# EAGLE design DAWA-SWITCH-6.3 (EAGLE 9.5.0)
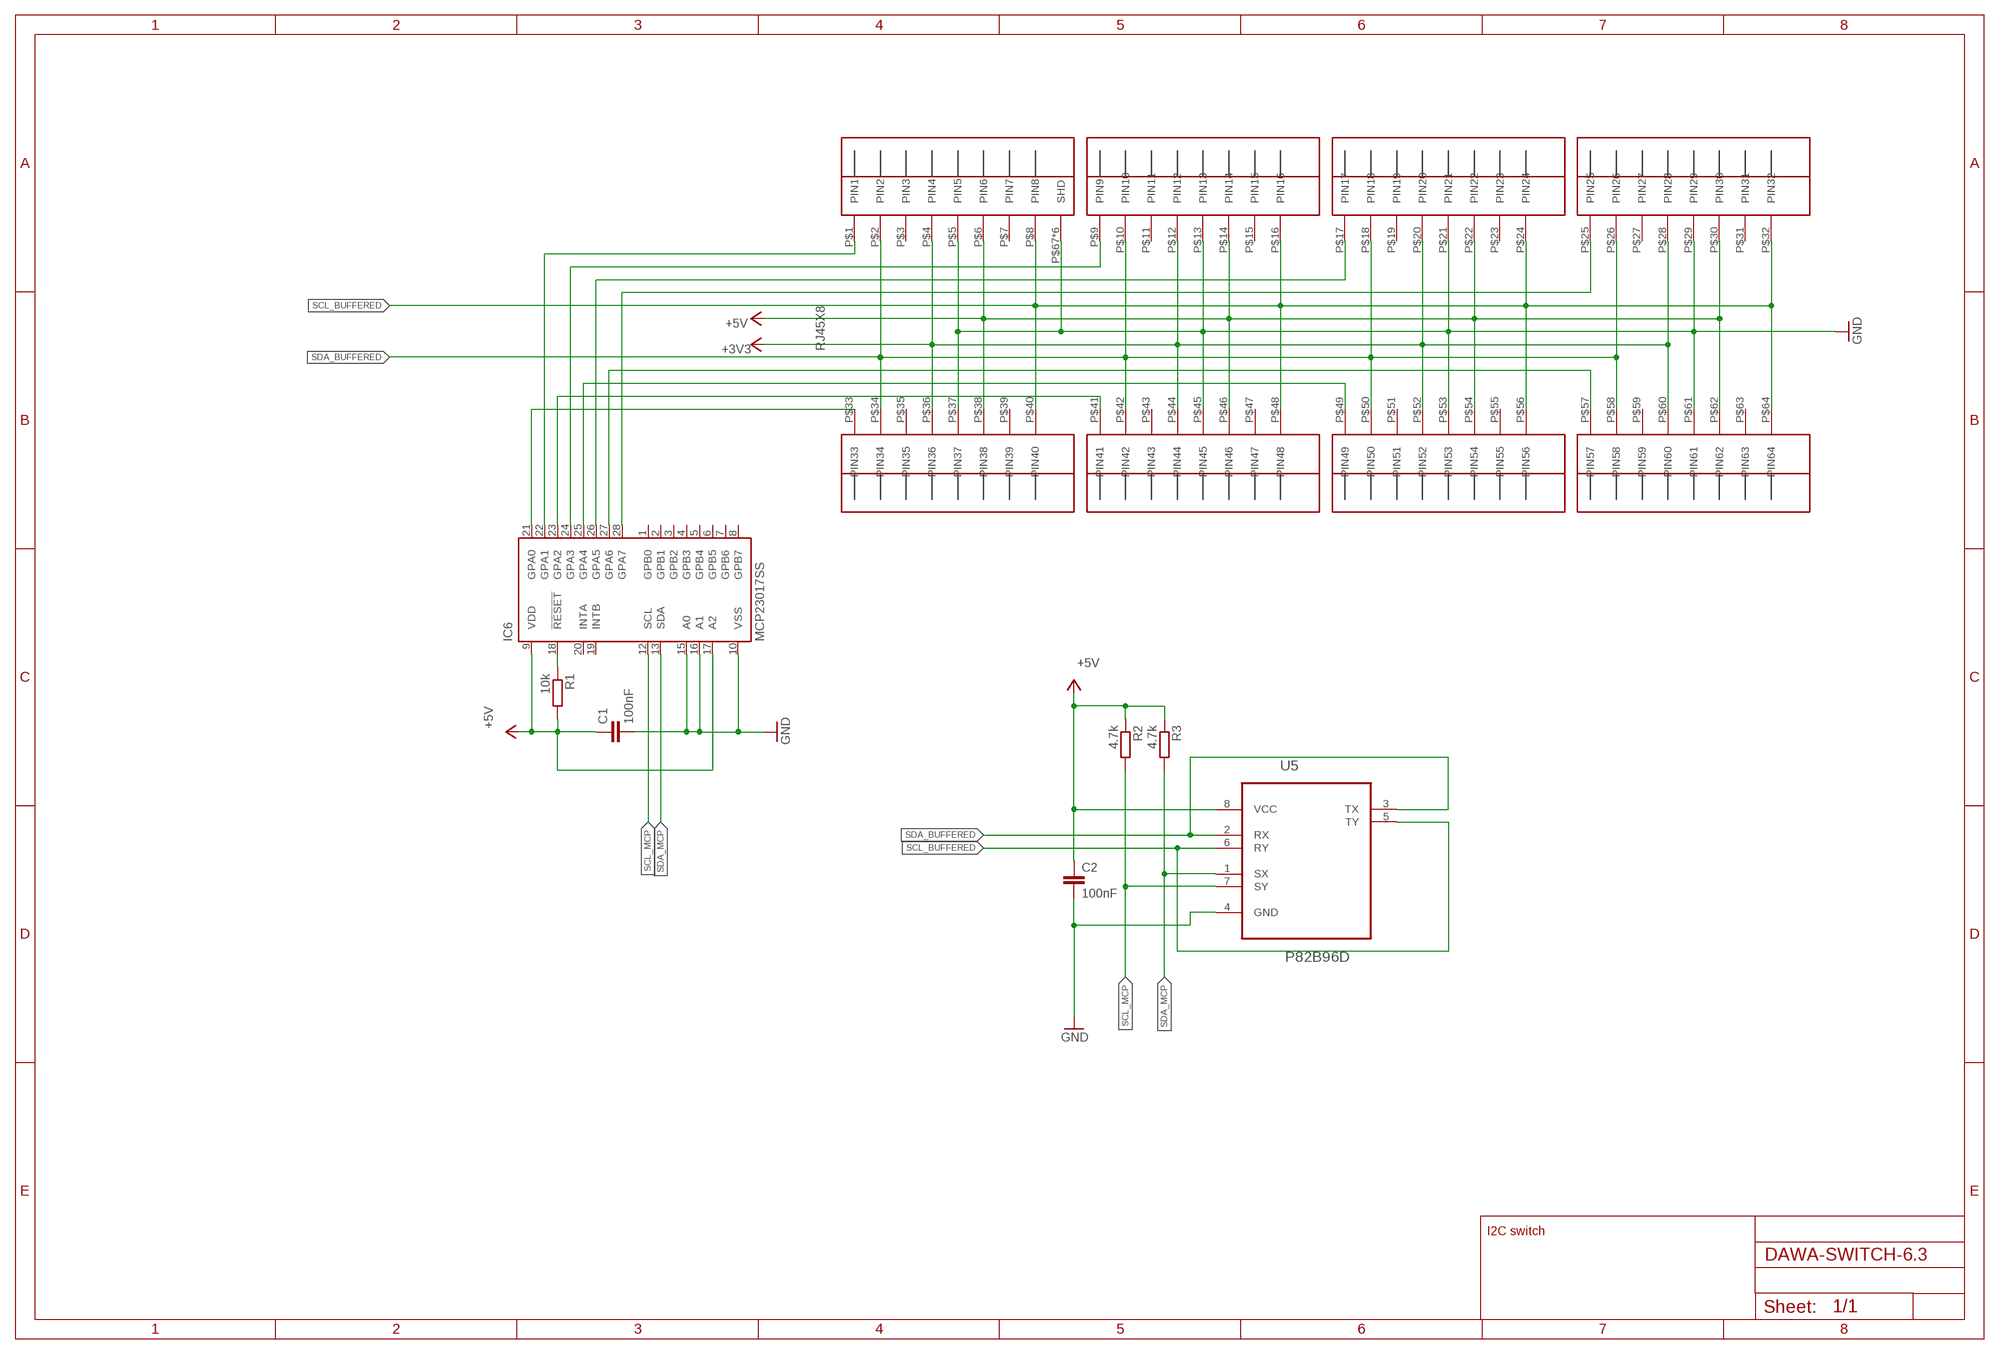
[diagram p0: schematic, sheet 1]

## Parts
C1  100nF  C-EUC0603  [C0603]
C2  100nF  C-EUC0603  [C0603]
IC6  MCP23017SS  [SSOP28]
R1  10k  R-EU_R0603  [R0603]
R2  4.7k  R-EU_R0603  [R0603]
R3  4.7k  R-EU_R0603  [R0603]
U5  P82B96D  [SOIC127P600X175-8N]
U$18  RJ45X8  [RJ45X8]

## Nets
+3V3: U$18.P$4(PIN4) U$18.P$12(PIN12) U$18.P$20(PIN20) U$18.P$28(PIN28) U$18.P$36(PIN36) U$18.P$44(PIN44) U$18.P$52(PIN52) U$18.P$60(PIN60)
+5V: C1.1 C2.1 IC6.9(VDD) IC6.17(A2) R1.2 R2.1 R3.1 U5.8(VCC) U$18.P$6(PIN6) U$18.P$14(PIN14) U$18.P$22(PIN22) U$18.P$30(PIN30) U$18.P$38(PIN38) U$18.P$46(PIN46) U$18.P$54(PIN54) U$18.P$62(PIN62)
GND: C1.2 C2.2 IC6.10(VSS) IC6.15(A0) IC6.16(A1) U5.4(GND) U$18.P$5(PIN5) U$18.P$13(PIN13) U$18.P$21(PIN21) U$18.P$29(PIN29) U$18.P$37(PIN37) U$18.P$45(PIN45) U$18.P$53(PIN53) U$18.P$61(PIN61) U$18.P$67(SHD) U$18.P$68(SHD) U$18.P$69(SHD) U$18.P$70(SHD) U$18.P$71(SHD) U$18.P$72(SHD)
N$35: IC6.28(GPA7) U$18.P$25(PIN25)
N$39: IC6.26(GPA5) U$18.P$17(PIN17)
N$40: IC6.24(GPA3) U$18.P$9(PIN9)
N$52: IC6.22(GPA1) U$18.P$1(PIN1)
N$53: IC6.21(GPA0) U$18.P$33(PIN33)
N$54: IC6.23(GPA2) U$18.P$41(PIN41)
N$55: IC6.25(GPA4) U$18.P$49(PIN49)
N$56: IC6.27(GPA6) U$18.P$57(PIN57)
N$57: IC6.18(!RESET) R1.1
SCL_BUFFERED: U5.5(TY) U5.6(RY) U$18.P$8(PIN8) U$18.P$16(PIN16) U$18.P$24(PIN24) U$18.P$32(PIN32) U$18.P$40(PIN40) U$18.P$48(PIN48) U$18.P$56(PIN56) U$18.P$64(PIN64)
SCL_MCP: IC6.12(SCL) R2.2 U5.7(SY)
SDA_BUFFERED: U5.2(RX) U5.3(TX) U$18.P$2(PIN2) U$18.P$10(PIN10) U$18.P$18(PIN18) U$18.P$26(PIN26) U$18.P$34(PIN34) U$18.P$42(PIN42) U$18.P$50(PIN50) U$18.P$58(PIN58)
SDA_MCP: IC6.13(SDA) R3.2 U5.1(SX)
Unconnected: IC6.1(GPB0) IC6.2(GPB1) IC6.3(GPB2) IC6.4(GPB3) IC6.5(GPB4) IC6.6(GPB5) IC6.7(GPB6) IC6.8(GPB7) IC6.19(INTB) IC6.20(INTA) U$18.P$3(PIN3) U$18.P$7(PIN7) U$18.P$11(PIN11) U$18.P$15(PIN15) U$18.P$19(PIN19) U$18.P$23(PIN23) U$18.P$27(PIN27) U$18.P$31(PIN31) U$18.P$35(PIN35) U$18.P$39(PIN39) U$18.P$43(PIN43) U$18.P$47(PIN47) U$18.P$51(PIN51) U$18.P$55(PIN55) U$18.P$59(PIN59) U$18.P$63(PIN63)

## Notes on the sheet
- I2C switch

## Library data of the parts
C1 = rcl:C-EU: CAPACITOR, European symbol; SPICEPREFIX: C
C2 = rcl:C-EU: CAPACITOR, European symbol
IC6 = adafruit:MCP23017: http://ww1.microchip.com/downloads/en/DeviceDoc/21952a.pdf Source: http://ww1.microchip.com/downloads/en/DeviceDoc/21952a.pdf
R1 = rcl:R-EU_: RESISTOR, European symbol; SPICEPREFIX: R
R2 R3 = resistor:R-EU_: RESISTOR, European symbol
U5 = TI:P82B96D: DUAL BIDIRECTIONAL BUS BUFFER; MPN: P82B96D; OC_FARNELL: 1831235; OC_NEWARK: 88K6383; PACKAGE: SOIC-8; SUPPLIER: Texas Instruments
U$18 = RJ45 Jack:RJ45X8

## Net classes
0 default: width 0.203 mm, drill 0.406 mm, clearance 0.203 mm
3 usbvcc: width 0.203 mm, drill 0.406 mm, clearance 0.203 mm
4 USBpair: width 0.254 mm, drill 0.406 mm, clearance 0.61 mm

## Board
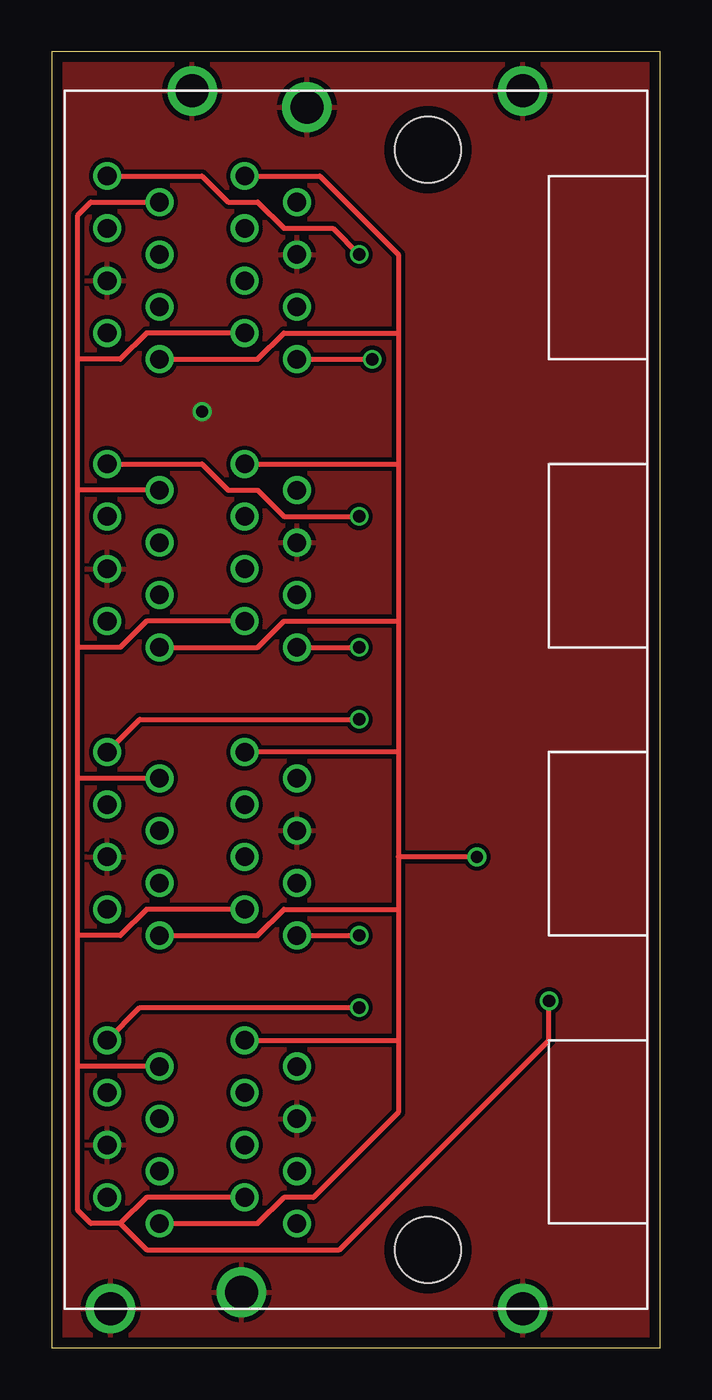
[diagram p1: board, top side]
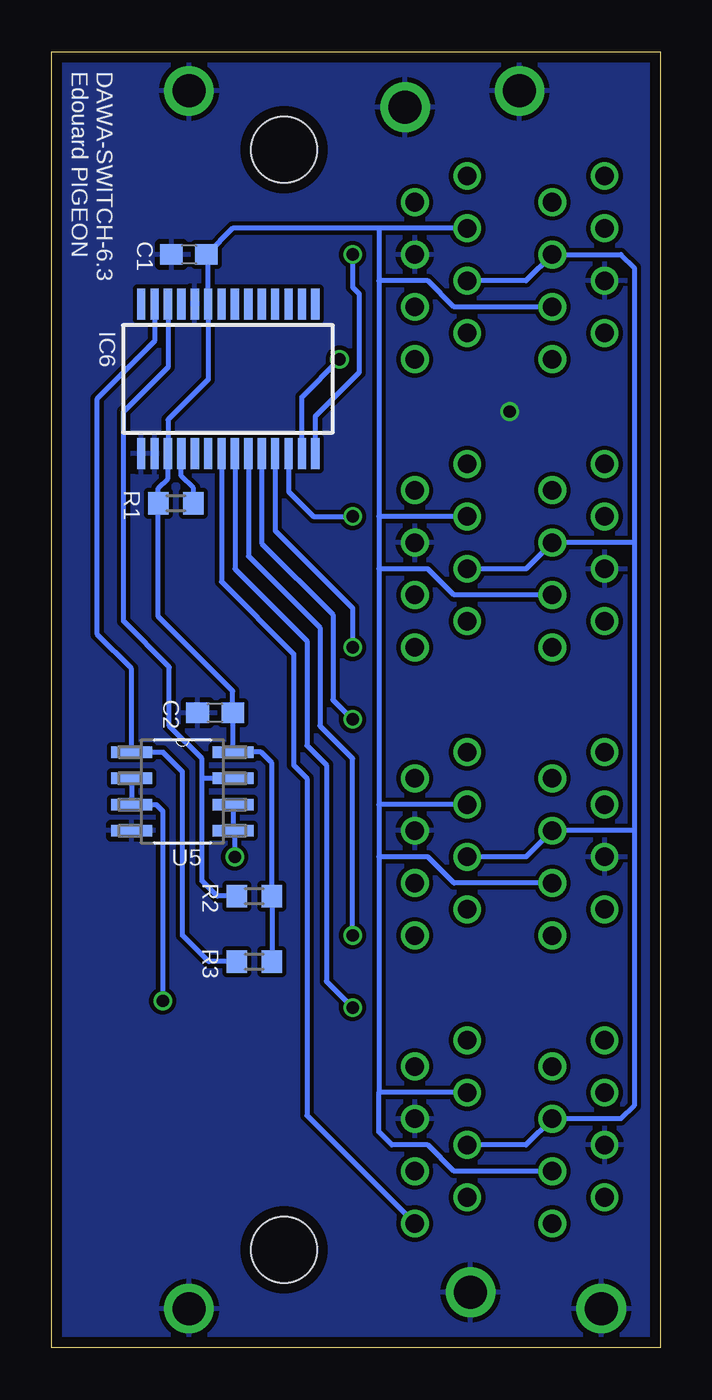
[diagram p2: board, bottom side, seen from below]

Size 29.53 x 62.87 mm. Coordinates in mm from the lower left corner, seen from the top.
Outline: 0,62.87 0,0 29.53,0 29.53,62.87 0,62.87
Copper layers (1*16): Top 0.035mm / dielectric 1.6mm / Bottom 0.035mm
Design rules "Elecrow_2-layer_PCB_eagle_rule *": minimum track width 6mil, minimum drill 12mil, track to track 6mil, track to pad 6mil, pad to pad 6mil, via to via 6mil, smd to smd 0mil, copper to edge 20mil, drill to drill 10mil, minimum pad ring 6mil, minimum via ring 6mil, stop-mask expansion 0mil, vias tented up to drill 100mil, thermal gap 10mil

### Footprints (pad centres in the part's own frame; a part is rotated, then mirrored left to right if it is on the bottom)
C0603 = smd 1.1 x 1: 1 -0.85,0; 2 0.85,0
SSOP28 = smd 0.4 x 1.5: 1 -4.225,-3.625; 2 -3.575,-3.625; 3 -2.925,-3.625; 4 -2.275,-3.625; 5 -1.625,-3.625; 6 -0.975,-3.625; 7 -0.325,-3.625; 8 0.325,-3.625; 9 0.975,-3.625; 10 1.625,-3.625; 11 2.275,-3.625; 12 2.925,-3.625; 13 3.575,-3.625; 14 4.225,-3.625; 15 4.225,3.625; 16 3.575,3.625; 17 2.925,3.625; 18 2.275,3.625; 19 1.625,3.625; 20 0.975,3.625; 21 0.325,3.625; 22 -0.325,3.625; 23 -0.975,3.625; 24 -1.625,3.625; 25 -2.275,3.625; 26 -2.925,3.625; 27 -3.575,3.625; 28 -4.225,3.625
R0603 = smd 1 x 1.1: 1 -0.85,0; 2 0.85,0
SOIC127P600X175-8N = smd 1.981 x 0.559: 1 -2.464,1.905; 2 -2.464,0.635; 3 -2.464,-0.635; 4 -2.464,-1.905; 5 2.464,-1.905; 6 2.464,-0.635; 7 2.464,0.635; 8 2.464,1.905
RJ45X8 = drill 0.9: P$1 13.018,22.701; P$2 11.748,20.161; P$3 10.477,22.701; P$4 9.207,20.161; P$5 7.938,22.701; P$6 6.668,20.161; P$7 5.397,22.701; P$8 4.128,20.161; P$9 26.988,22.701; P$10 25.718,20.161; P$11 24.448,22.701; P$12 23.177,20.161; P$13 21.907,22.701; P$14 20.637,20.161; P$15 19.367,22.701; P$16 18.098,20.161; P$17 40.958,22.701; P$18 39.688,20.161; P$19 38.417,22.701; P$20 37.148,20.161; P$21 35.877,22.701; P$22 34.608,20.161; P$23 33.337,22.701; P$24 32.068,20.161; P$25 54.928,22.701; P$26 53.657,20.161; P$27 52.388,22.701; P$28 51.117,20.161; P$29 49.847,22.701; P$30 48.578,20.161; P$31 47.307,22.701; P$32 46.038,20.161; P$33 4.128,13.494; P$34 5.397,16.034; P$35 6.668,13.494; P$36 7.938,16.034; P$37 9.207,13.494; P$38 10.477,16.034; P$39 11.748,13.494; P$40 13.018,16.034; P$41 18.098,13.494; P$42 19.367,16.034; P$43 20.637,13.494; P$44 21.907,16.034; P$45 23.177,13.494; P$46 24.448,16.034; P$47 25.718,13.494; P$48 26.988,16.034; P$49 32.068,13.494; P$50 33.337,16.034; P$51 34.608,13.494; P$52 35.877,16.034; P$53 37.148,13.494; P$54 38.417,16.034; P$55 39.688,13.494; P$56 40.958,16.034; P$57 46.038,13.494; P$58 47.307,16.034; P$59 48.578,13.494; P$60 49.847,16.034; P$61 51.117,13.494; P$62 52.388,16.034; P$63 53.657,13.494; P$64 54.928,16.034 | drill 1.6: P$67 0,22.543; P$68 0.794,16.192; P$69 0,2.54; P$70 59.055,2.54; P$71 58.261,13.018; P$72 59.055,18.574 | hole 3.2: 2.857,7.144; 56.197,7.144

### Placement (x,y rotation side)
C1  22.86,53.02 180 bottom
C2  21.59,30.8 180 bottom
IC6  20.95,46.99 180 bottom
R1  23.5,40.96 180 bottom
R2  19.68,21.91 180 bottom
R3  19.68,18.73 180 bottom
U5  23.18,26.99 0 bottom
U$18  25.4,1.91 90 top

### Tracks (layer width: path | path; a pad name or v marks a point on that pad's centre or on a via)
+3V3
  Bottom 0.254: U$18.P$60 6.51,51.75 U$18.P$28 1.91,53.02 1.27,52.39 1.27,39.05 | 1.27,39.05 1.27,25.08 | 1.27,25.08 1.27,11.75 1.91,11.11 U$18.P$4 6.51,9.84 U$18.P$36 | 1.27,25.08 U$18.P$12 6.51,23.81 U$18.P$44 | 1.27,39.05 U$18.P$20 6.51,37.78 U$18.P$52
+5V
  Bottom 0.254: R3.1 R2.1 18.84,28.36 19.37,28.89 U5.8 20.71,30.77 C2.1 20.74,31.85 24.34,35.46 R1.2 24.34,41.7 23.88,42.16 IC6.17 23.88,45.02 21.93,46.97 IC6.9 21.93,52.94 C1.1 20.74,54.29 13.65,54.29 | U$18.P$62 13.65,54.29 | 13.65,54.29 13.65,51.75 | 13.65,51.75 13.65,40.32 | 13.65,40.32 13.65,37.78 | 13.65,37.78 13.65,26.35 | 13.65,26.35 13.65,23.81 | 13.65,23.81 13.65,12.38 | U$18.P$6 10,8.57 11.27,9.84 13.02,9.84 13.65,10.48 13.65,12.38 | U$18.P$38 13.65,12.38 | U$18.P$14 10,22.54 11.27,23.81 13.65,23.81 | U$18.P$46 13.65,26.35 | U$18.P$22 10,36.51 11.27,37.78 13.65,37.78 | U$18.P$54 13.65,40.32 | U$18.P$30 10,50.48 11.27,51.75 13.65,51.75
GND  (via drill 0.6)
  other vias: 7.3,45.4
  pour Top: 29.53,0 0,0 0,62.87 29.53,62.87
  pour Bottom: 29.53,0 0,0 0,62.87 29.53,62.87
N$35  (via drill 0.6)
  Top 0.254: U$18.P$25 7.3,56.83 8.57,55.56 10,55.56 11.27,54.29 13.65,54.29 v14.92,53.02
  Bottom 0.254: IC6.28 16.73,45.18 14.61,47.31 14.61,51.12 14.92,51.44 v14.92,53.02
N$39  (via drill 0.6)
  Top 0.254: U$18.P$17 7.3,42.86 8.57,41.59 10,41.59 11.27,40.32 v14.92,40.32
  Bottom 0.254: v14.92,40.32 16.83,40.32 18.03,41.52 IC6.26
N$40  (via drill 0.6)
  Top 0.254: U$18.P$9 4.29,30.48 v14.92,30.48
  Bottom 0.254: v14.92,30.48 15.88,31.43 15.88,35.56 19.33,39.02 IC6.24
N$52  (via drill 0.6)
  Top 0.254: U$18.P$1 4.29,16.51 v14.92,16.51
  Bottom 0.254: v14.92,16.51 16.19,17.78 16.19,28.26 17.14,29.21 17.14,34.29 20.63,37.77 IC6.22
N$53
  Bottom 0.254: U$18.P$33 17.14,11.27 17.14,27.62 17.78,28.26 17.78,33.66 21.28,37.16 IC6.21
N$54  (via drill 0.6)
  Top 0.254: U$18.P$41 v14.92,20
  Bottom 0.254: v14.92,20 14.92,28.57 16.51,30.16 16.51,34.92 19.98,38.4 IC6.23
N$55  (via drill 0.6)
  Top 0.254: U$18.P$49 v14.92,33.97
  Bottom 0.254: v14.92,33.97 14.92,35.88 18.68,39.63 IC6.25
N$56  (via drill 0.6)
  Top 0.254: U$18.P$57 v15.56,47.94
  Bottom 0.254: IC6.27 17.38,46.12 v15.56,47.94
N$57
  Bottom 0.254: IC6.18 23.23,42.28 22.64,41.7 R1.1
SCL_BUFFERED  (via drill 0.6)
  Top 0.254: 16.83,49.21 16.83,53.02 13.02,56.83 U$18.P$64 | 16.83,49.21 16.83,42.86 | 16.83,42.86 16.83,35.24 | 16.83,35.24 16.83,28.89 | 16.83,28.89 16.83,23.81 | v20.64,23.81 16.83,23.81 | 16.83,28.89 U$18.P$48 | U$18.P$56 16.83,42.86 | 16.83,23.81 16.83,21.27 | 16.83,21.27 16.83,14.92 | U$18.P$40 16.83,14.92 | U$18.P$32 10,47.94 11.27,49.21 16.83,49.21 | U$18.P$24 10,33.97 11.27,35.24 16.83,35.24 | U$18.P$16 10,20 11.27,21.27 16.83,21.27 | U$18.P$8 10,6.03 11.27,7.3 12.7,7.3 16.83,11.43 16.83,14.92
  Bottom 0.254: U5.6 U5.5 20.64,25.01 v20.64,23.81
SCL_MCP
  Bottom 0.254: IC6.12 23.88,47.56 26.04,45.4 26.04,35.24 23.81,33.02 23.81,30.16 22.23,28.57 22.23,27.62 | 22.23,27.62 22.23,22.64 21.49,21.91 R2.2 | U5.7 22.23,27.62
SDA_BUFFERED  (via drill 0.6)
  Top 0.254: v24.13,16.83 24.13,14.92 13.97,4.76 4.6,4.76 3.33,6.03 | U$18.P$2 1.27,13.65 | 1.27,13.65 1.27,20 | 1.27,20 1.27,27.62 | 1.27,27.62 1.27,33.97 | 1.27,33.97 1.27,41.59 | 1.27,41.59 1.27,47.94 | 1.27,47.94 1.27,54.93 1.91,55.56 U$18.P$26 | U$18.P$18 1.27,41.59 | U$18.P$10 1.27,27.62 | U$18.P$58 4.6,49.21 3.33,47.94 1.27,47.94 | U$18.P$50 4.6,35.24 3.33,33.97 1.27,33.97 | U$18.P$42 4.6,21.27 3.33,20 1.27,20 | U$18.P$34 4.6,7.3 3.33,6.03 | 3.33,6.03 1.91,6.03 1.27,6.67 1.27,13.65
  Bottom 0.254: U5.2 U5.3 24.45,26.35 24.13,26.04 v24.13,16.83
SDA_MCP
  Bottom 0.254: IC6.13 24.53,48.81 27.3,46.04 27.3,34.61 25.64,32.94 U5.1 24.13,28.89 23.18,27.94 23.18,20 21.91,18.73 R3.2

### Text on the board
bNames: DAWA-SWITCH-6.3 / Edouard PIGEON